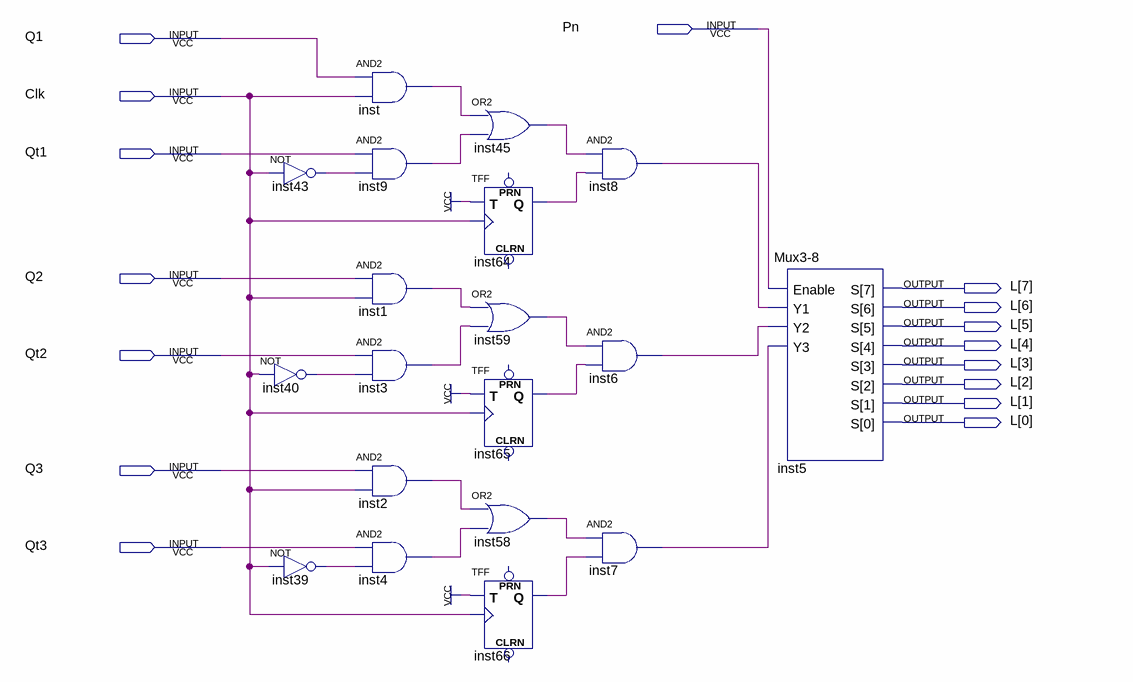
[diagram p0: schematic sheet]
// Quartus schematic ControleLin.bdf as structural Verilog: 19 symbols, 16 pins
module ControleLin (
  input  Pn,
  input  Q1,
  input  Clk,
  input  Qt1,
  input  Q2,
  input  Qt2,
  input  Q3,
  input  Qt3,
  output [7:0] L
);

  wire inst1_out, inst2_out, inst3_out, inst4_out, inst6_out, inst7_out, inst8_out, inst9_out, inst39_out,
       inst40_out, inst43_out, inst45_out, inst58_out, inst59_out, inst64_q, inst65_q, inst66_q, inst_out;

  not inst43 (inst43_out, Clk);
  not inst40 (inst40_out, Clk);
  not inst39 (inst39_out, Clk);
  and inst (inst_out, Q1, Clk);
  and inst9 (inst9_out, Qt1, inst43_out);
  and inst1 (inst1_out, Q2, Clk);
  and inst3 (inst3_out, Qt2, inst40_out);
  and inst2 (inst2_out, Q3, Clk);
  and inst4 (inst4_out, Qt3, inst39_out);
  or inst45 (inst45_out, inst_out, inst9_out);
  TFF inst64 (.T(1'b1), .CLK(Clk), .Q(inst64_q));  // open: PRN, CLRN
  or inst59 (inst59_out, inst1_out, inst3_out);
  TFF inst65 (.T(1'b1), .CLK(Clk), .Q(inst65_q));  // open: PRN, CLRN
  or inst58 (inst58_out, inst2_out, inst4_out);
  TFF inst66 (.T(1'b1), .CLK(Clk), .Q(inst66_q));  // open: PRN, CLRN
  and inst8 (inst8_out, inst45_out, inst64_q);
  and inst6 (inst6_out, inst59_out, inst65_q);
  and inst7 (inst7_out, inst58_out, inst66_q);
  \Mux3-8  inst5 (.Enable(Pn), .Y1(inst8_out), .Y2(inst6_out), .Y3(inst7_out), .S(L));
endmodule
